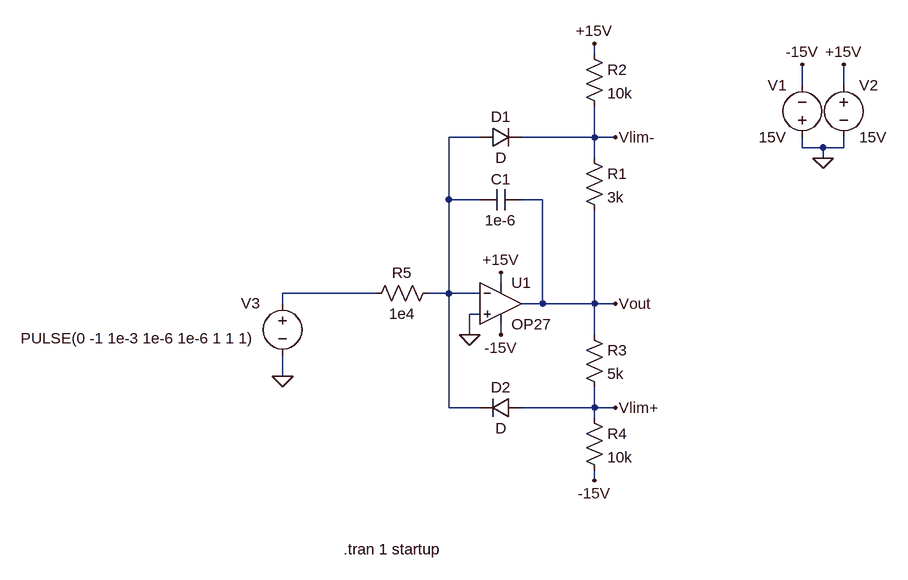
[diagram p0: schematic Draft4.asc]
Draft4.asc, the LTspice schematic file:
Version 4
SHEET 1 880 680
WIRE 320 -208 320 -224
WIRE 640 -160 640 -192
WIRE 704 -160 704 -192
WIRE 144 -80 96 -80
WIRE 320 -80 320 -128
WIRE 320 -80 208 -80
WIRE 352 -80 320 -80
WIRE 640 -64 640 -80
WIRE 672 -64 640 -64
WIRE 704 -64 704 -80
WIRE 704 -64 672 -64
WIRE 320 -48 320 -80
WIRE 672 -48 672 -64
WIRE 96 16 96 -80
WIRE 144 16 96 16
WIRE 240 16 208 16
WIRE 176 144 176 128
WIRE -16 160 -160 160
WIRE 96 160 96 16
WIRE 96 160 64 160
WIRE 144 160 96 160
WIRE -160 176 -160 160
WIRE 240 176 240 16
WIRE 240 176 208 176
WIRE 320 176 320 32
WIRE 320 176 240 176
WIRE 352 176 320 176
WIRE 144 192 128 192
WIRE 128 224 128 192
WIRE 176 224 176 208
WIRE 320 224 320 176
WIRE -160 288 -160 256
WIRE 96 336 96 160
WIRE 144 336 96 336
WIRE 320 336 320 304
WIRE 320 336 208 336
WIRE 352 336 320 336
WIRE 320 352 320 336
WIRE 320 448 320 432
FLAG 128 224 0
FLAG 672 -48 0
FLAG 704 -192 +15V
FLAG 640 -192 -15V
FLAG 176 128 +15V
FLAG 176 224 -15V
FLAG 320 -224 +15V
FLAG 320 448 -15V
FLAG -160 288 0
FLAG 352 176 Vout
FLAG 352 336 Vlim+
FLAG 352 -80 Vlim-
SYMBOL Opamps\\OP27 176 112 R0
SYMATTR InstName U1
SYMBOL cap 208 0 R90
WINDOW 0 0 32 VBottom 2
WINDOW 3 32 32 VTop 2
SYMATTR InstName C1
SYMATTR Value 1e-6
SYMBOL voltage 640 -64 R180
WINDOW 0 24 96 Left 2
WINDOW 3 24 16 Left 2
WINDOW 123 0 0 Left 2
WINDOW 39 0 0 Left 2
SYMATTR InstName V1
SYMATTR Value 15V
SYMBOL voltage 704 -176 R0
WINDOW 123 0 0 Left 2
WINDOW 39 0 0 Left 2
SYMATTR InstName V2
SYMATTR Value 15V
SYMBOL diode 144 -64 R270
WINDOW 0 32 32 VTop 2
WINDOW 3 0 32 VBottom 2
SYMATTR InstName D1
SYMBOL res 304 -64 R0
SYMATTR InstName R1
SYMATTR Value 3k
SYMBOL res 304 -224 R0
SYMATTR InstName R2
SYMATTR Value 10k
SYMBOL res 304 208 R0
SYMATTR InstName R3
SYMATTR Value 5k
SYMBOL res 304 336 R0
SYMATTR InstName R4
SYMATTR Value 10k
SYMBOL diode 208 320 R90
WINDOW 0 0 32 VBottom 2
WINDOW 3 32 32 VTop 2
SYMATTR InstName D2
SYMBOL voltage -160 160 R0
WINDOW 0 -64 15 Left 2
WINDOW 3 -403 69 Left 2
WINDOW 123 0 0 Left 2
WINDOW 39 0 0 Left 2
SYMATTR InstName V3
SYMATTR Value PULSE(0 -1 1e-3 1e-6 1e-6 1 1 1)
SYMBOL res 80 144 R90
WINDOW 0 0 56 VBottom 2
WINDOW 3 32 56 VTop 2
SYMATTR InstName R5
SYMATTR Value 1e4
TEXT -66 554 Left 2 !.tran 1 startup

The netlist it stands for:
* Draft4.asc
XU1 0 N001 +15V -15V Vout OP27  ; pins In+ In- V+ V- OUT
C1 Vout N001 1e-6
V1 0 -15V 15V
V2 +15V 0 15V
D1 N001 Vlim- D
R1 Vlim- Vout 3k
R2 +15V Vlim- 10k
R3 Vout Vlim+ 5k
R4 Vlim+ -15V 10k
D2 Vlim+ N001 D
V3 N002 0 PULSE(0 -1 1e-3 1e-6 1e-6 1 1 1)
R5 N001 N002 1e4
.model D D
.lib standard.dio
.tran 1 startup
.lib ADI.lib
.backanno
.end

* Results of the author's LTspice run, read from the files saved beside the schematic
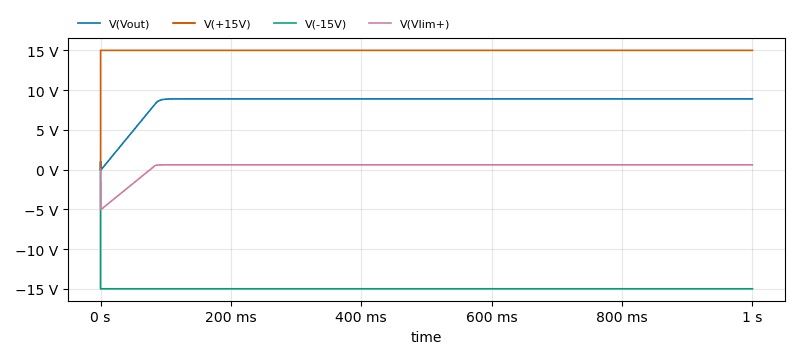
[diagram p1: Transient Analysis of Draft4.asc, plotted from the saved traces]
* Transient Analysis, 1 run:
*   V(Vout): min -24.93 mV, max 8.893 V, average 8.487 V, rms 8.631 V, last 8.893 V
*   V(+15V): min 0 V, max 15 V, average 15 V, rms 15 V, last 15 V
*   V(-15V): min -15 V, max 0 V, average -15 V, rms 15 V, last -15 V
*   V(Vlim+): min -5 V, max 595.6 mV, average 354.9 mV, rms 1.032 V, last 595.6 mV